# EAGLE design Grove - 6-Axis Accelerometer&Compass (EAGLE 6.4)
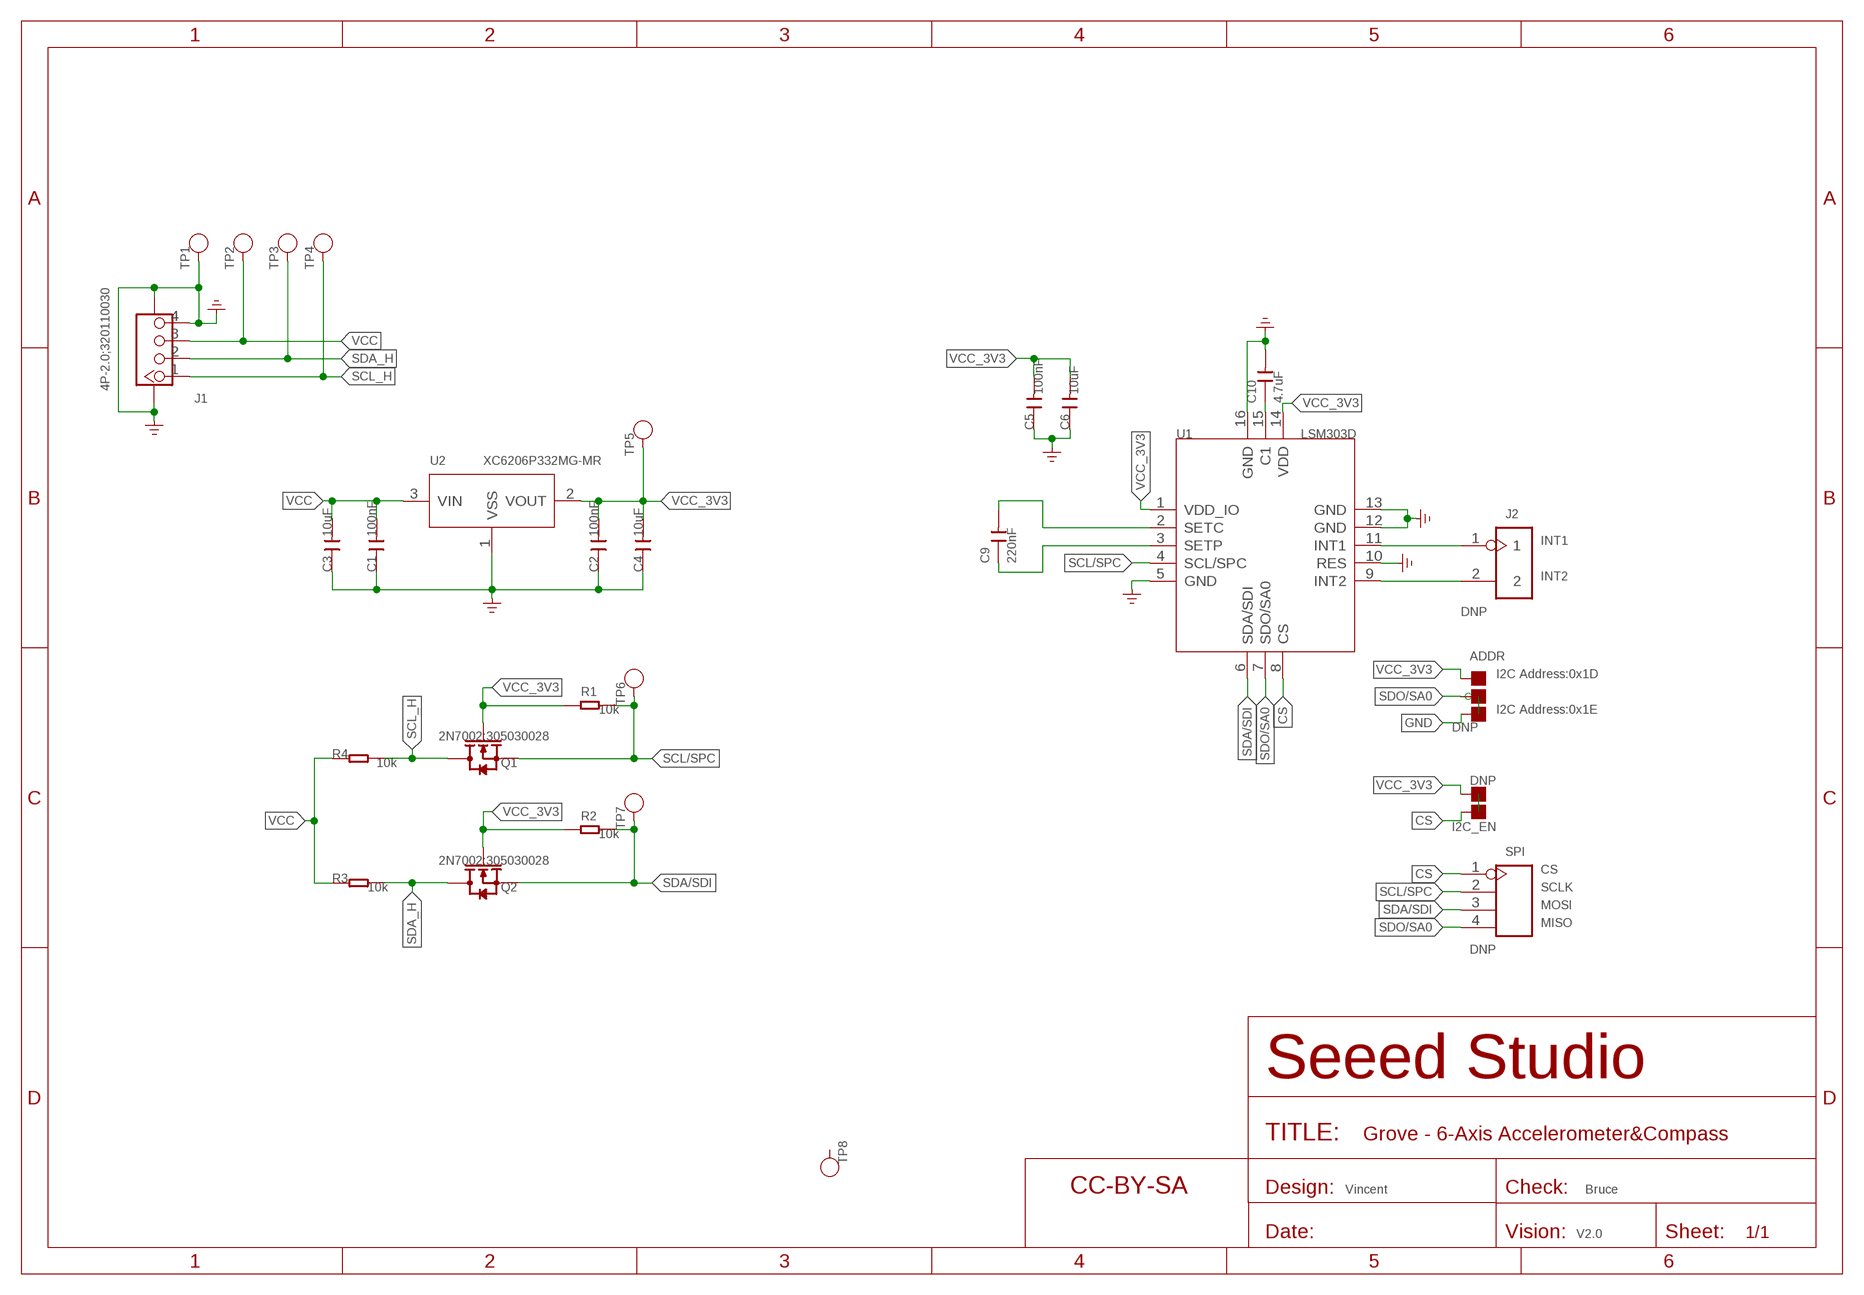
[diagram p0: schematic, sheet 1]

## Parts
ADDR  DNP  PAD-JUMPER-3P-40*40  [3P-SMD-L4.1*W1.5MM]
C1  100nF  CAP-0603  [C0603]
C2  100nF  CAP-0603  [C0603]
C3  10uF  CAP-0805  [C0805]
C4  10uF  CAP-0805  [C0805]
C5  100nF  CAP-0603  [C0603]
C6  10uF  CAP-0805  [C0805]
C9  220nF  CAP-0603  [C0603]
C10  4.7uF  CAP-0603  [C0603]
I2C_EN  DNP  PAD-JUMPER-2P  [2P-SMD-L1.78*W1.27MM]
J1  4P-2.0;320110030  GROVE-CONNECTOR-SMD'DD'  [4P-SMD-2.0]
J2  DNP  HEADER-2P-65/35MIL  [2P-2.54-65/35MIL]
Q1  2N7002;305030028  MOSFET-N'SOT23'  [SOT-23]
Q2  2N7002;305030028  MOSFET-N'SOT23'  [SOT-23]
R1  10k  RES-0603  [R0603]
R2  10k  RES-0603  [R0603]
R3  10k  RES-0603  [R0603]
R4  10k  RES-0603  [R0603]
SPI  DNP  HEADER-4P-65/35MIL  [4P-2.54-65/35MIL]
TP1  DNP  PAD-TEST-POINT'4545'  [TP-D45MIL]
TP2  DNP  PAD-TEST-POINT'4545'  [TP-D45MIL]
TP3  DNP  PAD-TEST-POINT'4545'  [TP-D45MIL]
TP4  DNP  PAD-TEST-POINT'4545'  [TP-D45MIL]
TP5  DNP  PAD-TEST-POINT'4545'  [TP-D45MIL]
TP6  DNP  PAD-TEST-POINT'4545'  [TP-D45MIL]
TP7  DNP  PAD-TEST-POINT'4545'  [TP-D45MIL]
TP8  DNP  PAD-TEST-POINT'4545'  [TP-D45MIL]
U1  LSM303D  [LGA-16]
U2  XC6206P332MG-MR  PMIC-XC6206PMR  [SOT-23]
U$1  SEEEDSTUDIO-OPEN-SCH-FRAME  [SEEEDSTUDIO-PCB-FRAME]

## Nets
CS: I2C_EN.2 SPI.1 U1.8(CS)
GND: ADDR.11(R) C1.1 C2.1 C3.1 C4.1 C5.1 C6.1 C10.2 J1.4 J1.SS1 J1.SS2 TP1.T U1.5(GND) U1.10(RES) U1.12(GND) U1.13(GND) U1.16(GND) U2.1(VSS) ; supply symbol labelled GND_POWER
N$1: C9.2 U1.2(SETC)
N$2: C9.1 U1.3(SETP)
N$4: C10.1 U1.15(C1)
N$11: J2.2 U1.9(INT2)
N$12: J2.1 U1.11(INT1)
SCL/SPC: Q1.2(S) R1.2 SPI.2 TP6.T U1.4(SCL/SPC)
SCL_H: J1.1 Q1.3(D) R4.2 TP4.T
SDA/SDI: Q2.2(S) R2.2 SPI.3 TP7.T U1.6(SDA/SDI)
SDA_H: J1.2 Q2.3(D) R3.2 TP3.T
SDO/SA0: ADDR.MM(C) SPI.4 U1.7(SDO/SA0)
VCC: C1.2 C3.2 J1.3 R3.1 R4.1 TP2.T U2.3(VIN)
VCC_3V3: ADDR.00(L) C2.2 C4.2 C5.2 C6.2 I2C_EN.1 Q1.1(G) Q2.1(G) R1.1 R2.1 TP5.T U1.1(VDD_IO) U1.14(VDD) U2.2(VOUT)
Unconnected: TP8.T

## Notes on the sheet
- INT1
- INT2
- I2C Address:0x1D
- I2C Address:0x1E
- CS
- SCLK
- MOSI
- MISO
- Vincent | Bruce
- V2.0

## Library data of the parts
ADDR = Discrete-new:PAD-JUMPER-3P; PARTNO: DNP
C1-C6 C9 C10 = Discrete-new:CAP: Ceramic Capacitors
I2C_EN = Discrete-new:PAD-JUMPER-2P; PARTNO: DNP
J1 = Connector-new:GROVE-CONNECTOR-SMD: 4P-SMD-2.0:320110030;4P-SMD-2.0-90D:320110032
J2 = Connector-new:HEADER-2P
Q1 Q2 = Discrete-new:MOSFET-N: IRLL014: http://www.vishay.com/docs/91319/sihll014.pdf
R1-R4 = Discrete-new:RES
SPI = Connector-new:HEADER-4P
TP1-TP8 = Discrete-new:PAD-TEST-POINT; PARTNO: DNP
U1 = template:LSM303D: Ultra-compact high-performance eCompass module: 3D accelerometer and 3D magnetometer
U2 = IC-new:PMIC-XC6206P: LOW ESR Cap.Compatible Positive Voltage Regulators
U$1 = moudle-new:SEEEDSTUDIO-OPEN-SCH-FRAME

## Net classes
0 default: width 0.152 mm, drill 0.305 mm, clearance 0.152 mm

## Board
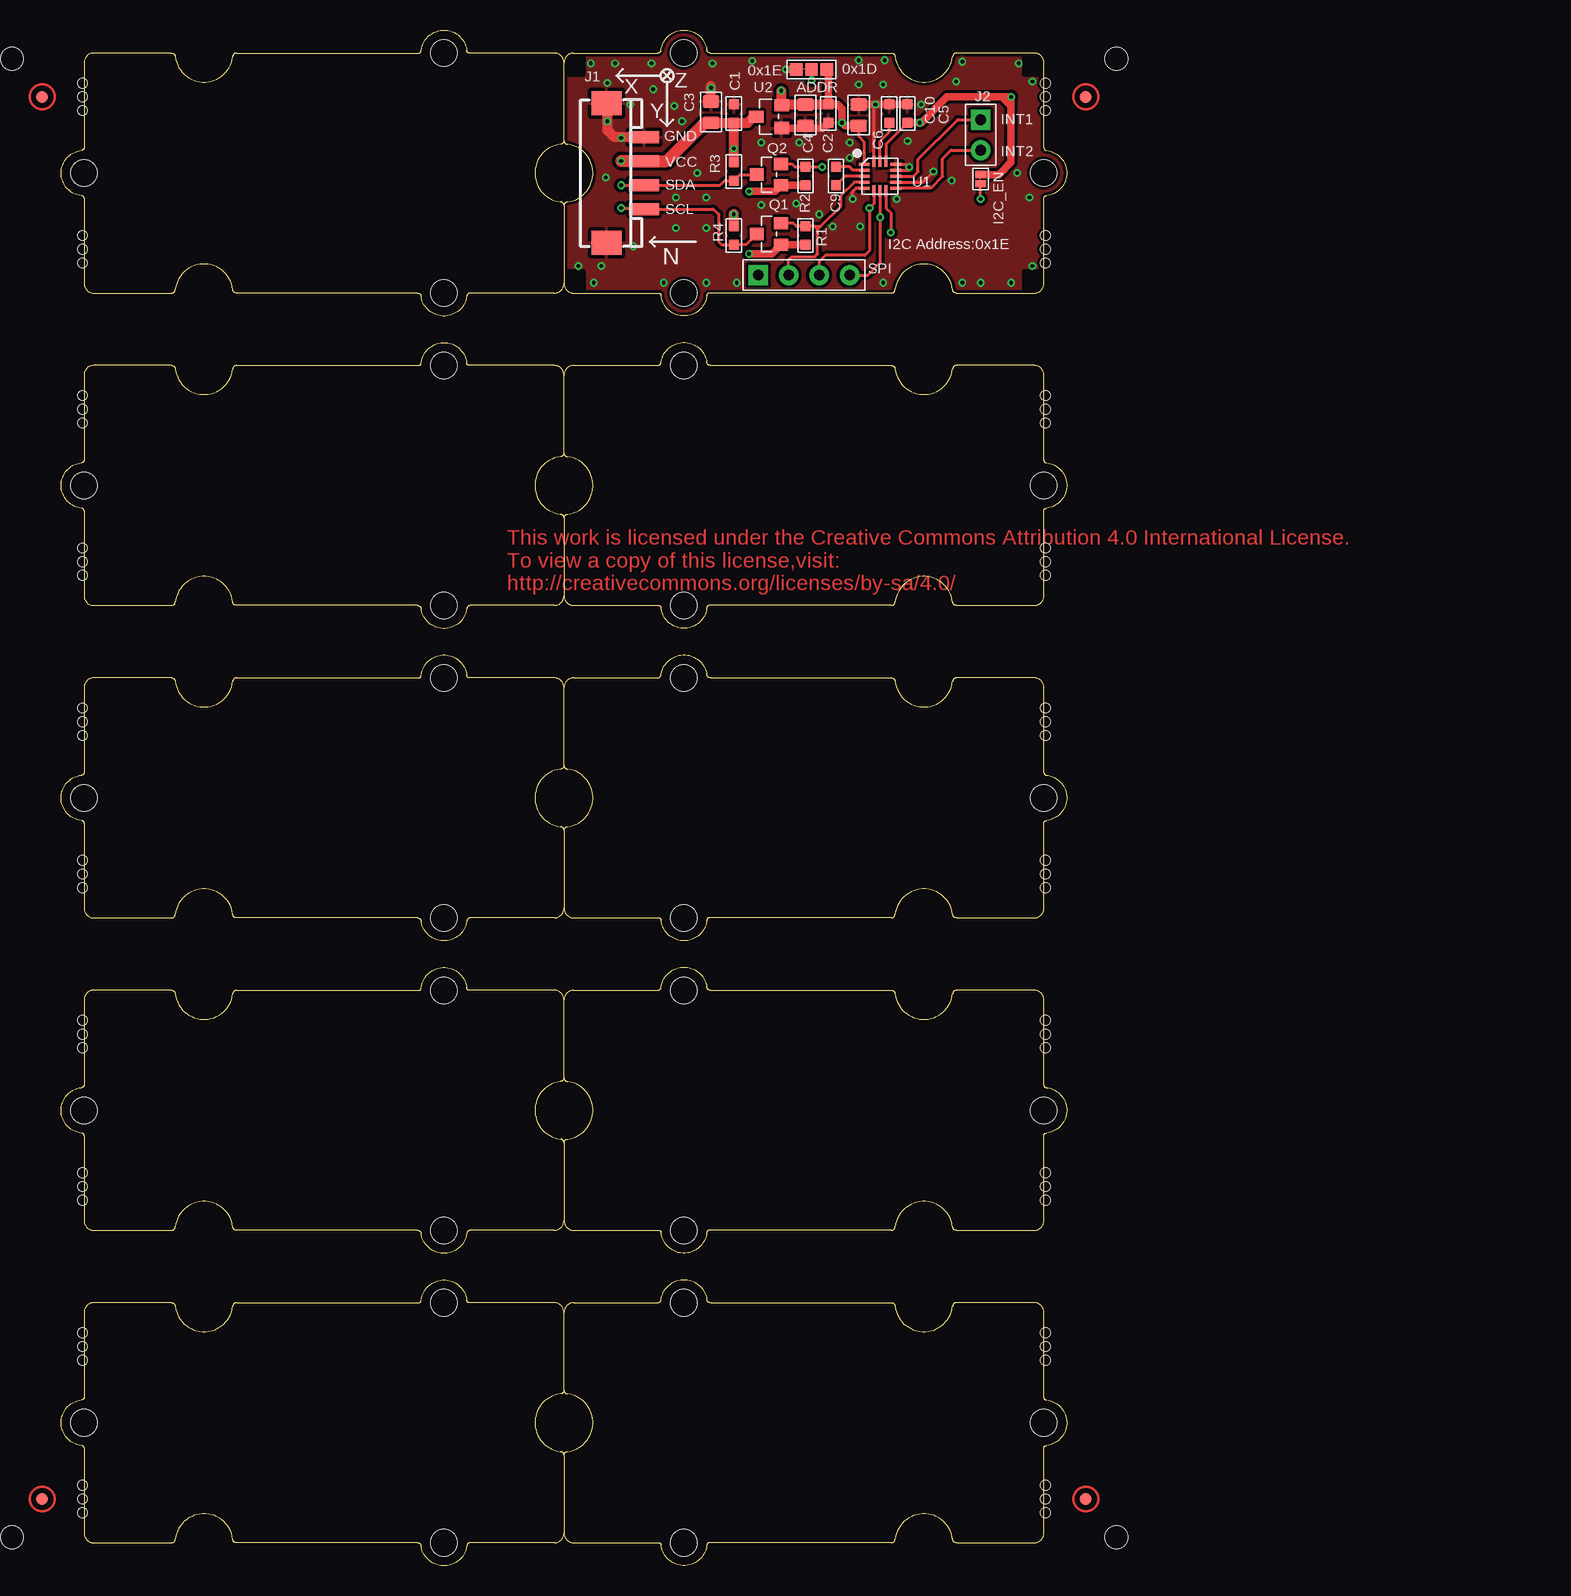
[diagram p1: board, top side]
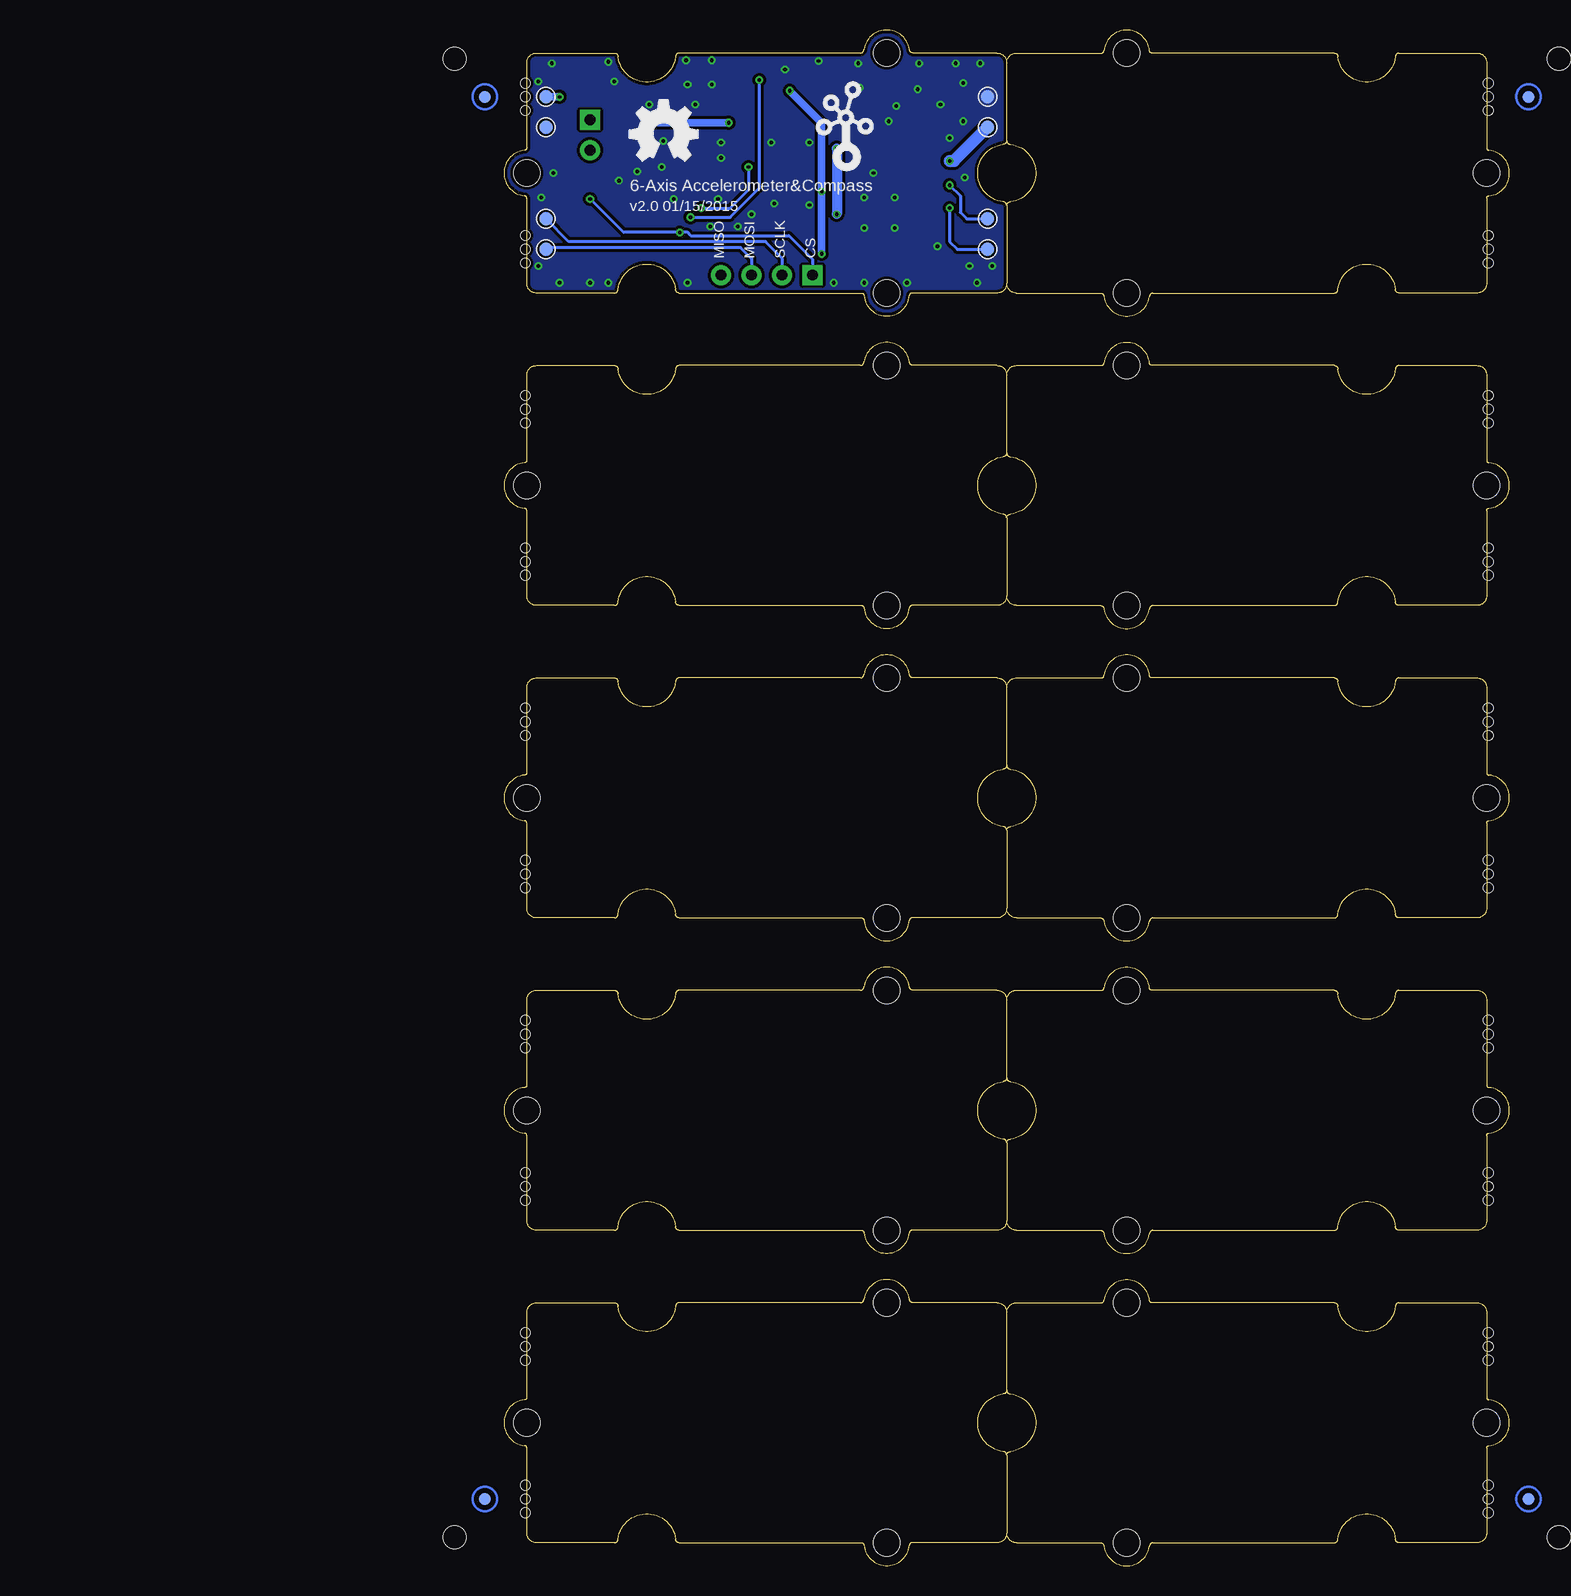
[diagram p2: board, bottom side, seen from below]

Size 83.82 x 127.98 mm. Coordinates in mm from the lower left corner, seen from the top.
Copper layers (1*16): Top 0.035mm / dielectric 1.5mm / Bottom 0.035mm
Design rules "SeeedStudio_2layer_DRU_no_angle_20140221 *": minimum track width 6mil, minimum drill 12mil, track to track 6mil, track to pad 6mil, pad to pad 6mil, via to via 6mil, smd to smd 0mil, copper to edge 10mil, drill to drill 10mil, minimum pad ring 10mil, minimum via ring 6mil, stop-mask expansion 2mil, vias tented up to drill 25mil, thermal gap 12mil
Holes 0.8 mm at 1.78,123.55 1.78,121.27 1.78,122.41 1.78,110.85 1.78,108.57 1.78,109.71 1.78,97.52 1.78,95.23 1.78,96.38 1.78,84.82 1.78,82.53 1.78,83.68 1.78,71.48 1.78,69.2 1.78,70.34 1.78,58.78 1.78,56.5 1.78,57.64 1.78,45.45 1.78,43.16 1.78,44.31 1.78,32.75 1.78,30.46 1.78,31.61 1.78,19.41 1.78,17.13 1.78,18.27 1.78,6.71 1.78,4.43 1.78,5.57 82.04,121.27 82.04,123.55 82.04,122.41 82.04,108.57 82.04,110.85 82.04,109.71 82.04,95.23 82.04,97.52 82.04,96.38 82.04,82.53 82.04,84.82 82.04,83.68 82.04,69.2 82.04,71.48 82.04,70.34 82.04,56.5 82.04,58.78 82.04,57.64 82.04,43.16 82.04,45.45 82.04,44.31 82.04,30.46 82.04,32.75 82.04,31.61 82.04,17.13 82.04,19.41 82.04,18.27 82.04,4.43 82.04,6.71 82.04,5.57
Holes 1.91 mm at -4.13,2.4 87.95,2.4 87.95,125.59 -4.13,125.59

### Footprints (pad centres in the part's own frame; a part is rotated, then mirrored left to right if it is on the bottom)
3P-SMD-L4.1*W1.5MM = smd 1.016 x 1.016: 00 -1.27,0; 11 1.27,0; MM 0,0
C0603 = smd 0.889 x 0.889: 1 -0.762,0; 2 0.762,0
C0805 = smd 1.016 x 1.397: 1 -0.889,0; 2 0.889,0
2P-SMD-L1.78*W1.27MM = smd 0.889 x 0.61: 1 0,0.381; 2 0,-0.381
4P-SMD-2.0 = smd 1 x 2.5: 1 -3,0; 2 -1,0; 3 1,0; 4 3,0 | smd 2 x 2.5: SS1 -5.8,3.123; SS2 5.8,3.123
2P-2.54-65/35MIL = drill 0.889 pad 1.651 square: 1 0,1.27 | drill 0.889 pad 1.651: 2 0,-1.27
ROUND-MARK-1.0 = smd 1.016 x 1.016: P$1 0,0
SOT-23 = smd 1.016 x 1.143: 1 -0.889,-1.016; 2 0.889,-1.016; 3 0,1.016
R0603 = smd 0.889 x 0.889: 1 -0.762,0; 2 0.762,0
4P-2.54-65/35MIL = drill 0.889 pad 1.651 square: 1 0,3.81 | drill 0.889 pad 1.651: 2 0,1.27; 3 0,-1.27; 4 0,-3.81
TP-D45MIL = smd 1.143 x 1.143: T 0,0
LGA-16 = smd 0.9 x 0.25: 1 -1.33,1; 2 -1.33,0.5; 3 -1.33,0; 4 -1.33,-0.5; 5 -1.33,-1; 9 1.33,-1; 10 1.33,-0.5; 11 1.33,0; 12 1.33,0.5; 13 1.33,1 | smd 0.25 x 0.9: 6 -0.5,-1.23; 7 0,-1.23; 8 0.5,-1.23; 14 0.5,1.23; 15 0,1.23; 16 -0.5,1.23
SOT-23' = smd 1.016 x 1.2: 1 -0.95,-1.06; 2 0.95,-1.06; 3 0,1.06
GROVE-TEST-PLATFORM = hole 2.2: -10,-10; -10,10; 20,0
GROVE-1*2-TEST-PLATFORM = hole 2.2: -10,-10; -10,10; 20,0

### Placement (x,y rotation side)
ADDR  62.55,124.7 180 top
C1  56.07,121.01 270 top
C2  63.95,121.01 90 top
C3  54.17,121.14 270 top
C4  62.04,120.89 90 top
C5  70.55,121.01 270 top
C6  66.49,120.89 270 top
C9  64.58,115.81 90 top
C10  69.03,121.01 90 top
I2C_EN  76.65,115.55 0 top
J1  48.58,116.06 90 top
J2  76.65,119.24 0 top
P1  [ROUND-MARK-1.0]  -1.59,5.57 0 top
P2  [ROUND-MARK-1.0]  85.41,5.57 0 top
P3  [ROUND-MARK-1.0]  -1.59,122.41 0 top
P4  [ROUND-MARK-1.0]  85.41,122.41 0 top
P5  [ROUND-MARK-1.0]  -1.59,5.57 0 bottom
P6  [ROUND-MARK-1.0]  85.41,5.57 0 bottom
P7  [ROUND-MARK-1.0]  85.41,122.41 0 bottom
P8  [ROUND-MARK-1.0]  -1.59,122.41 0 bottom
Q1  58.99,110.98 90 top
Q2  58.99,115.93 90 top
R1  62.04,110.85 90 top
R2  62.04,115.81 90 top
R3  56.07,116.19 270 top
R4  56.07,110.85 270 top
SPI  61.91,107.55 90 top
TP1  43.5,122.41 0 bottom
TP2  43.5,119.87 0 bottom
TP3  43.5,112.25 0 bottom
TP4  43.5,109.71 0 bottom
TP5  80.33,122.41 0 bottom
TP6  80.33,112.25 0 bottom
TP7  80.33,109.71 0 bottom
TP8  80.33,119.87 0 bottom
U1  68.26,115.81 0 top
U2  XC6206P332MG-MR  [SOT-23']  58.99,120.76 90 top
U3  [GROVE-TEST-PLATFORM]  61.91,37.96 0 top
U4  [GROVE-TEST-PLATFORM]  21.91,37.96 180 top
U5  [GROVE-TEST-PLATFORM]  61.91,63.99 0 top
U6  [GROVE-TEST-PLATFORM]  21.91,63.99 180 top
U7  [GROVE-TEST-PLATFORM]  61.91,90.03 0 top
U8  [GROVE-TEST-PLATFORM]  21.91,90.03 180 top
U9  [GROVE-TEST-PLATFORM]  21.91,116.06 180 top
U10  [GROVE-TEST-PLATFORM]  61.91,116.06 0 top
U11  [GROVE-TEST-PLATFORM]  61.91,11.92 0 top
U12  [GROVE-TEST-PLATFORM]  21.91,11.92 180 top
U$1  37.15,81.26 0 top
U$10  [GROVE-1*2-TEST-PLATFORM]  61.91,116.06 0 top
U$11  [GROVE-SILK-BIG]  55.31,117.2 0 bottom
U$12  [OSHW_FILLX200_NOTEXT]  73.34,117.08 0 bottom

### Tracks (layer width: path | path; a pad name or v marks a point on that pad's centre or on a via)
CS  (via drill 0.3 pad 0.64)
  Top 0.102: I2C_EN.2 76.65,115.93
  Top 0.254: U1.8 68.76,113.15 69.15,112.76 v69.15,111.11 | v76.65,113.9 I2C_EN.2
  Bottom 0.254: SPI.1 58.1,108.88 60.08,110.85 68.26,110.85 68.52,111.11 v69.15,111.11 73.85,111.11 v76.65,113.9
GND  (via drill 0.3 pad 0.64)
  Top 0.254: U1.16 67.76,121.66 v67.88,121.78 | U1.13 70.69,116.81 70.69,116.31 U1.12 | 66.76,114.81 66.25,114.81 65.98,114.54 v65.98,113.9 | U1.10 71.83,115.31 v72.71,116.19
  Top 0.61: C2.1 63.5,119.81 U2.1 59.95,119.81 | C6.1 v67.88,121.78 C5.1 | ADDR.11 v60.39,124.7
  Top 0.813: J1.4 46.09,119.06 45.53,119.62 45.53,121.79 J1.SS2 | C3.1 54.17,123.3
  other vias: 66.49,125.46 68.64,125.46 70.68,116.57 74.61,123.68 75.12,125.33 80.71,114.03 79.19,106.92 76.65,106.92 75.12,106.92 68.52,106.92 56.33,106.92 53.79,106.92 50.23,106.92 44.39,106.92 43.12,108.31 44.13,125.21 46.17,125.21 49.21,125.21 54.29,125.21 57.6,125.4 70.55,118.73 65.72,118.6 65.72,117.33 61.53,118.6 66.49,123.43 68.52,123.43 47.69,109.97 51.25,114.03 53.79,114.03 53.79,111.49 51.25,111.49 46.67,118.98 45.53,120.38 45.53,123.55 47.44,121.78 54.17,123.17 58.36,118.6 45.4,115.68 53.02,116.06 45.02,108.31 80.96,108.31 79.69,116.06 80.96,123.68 79.82,125.21 71.69,121.78 69.66,113.9 74.23,115.43 66.61,111.62 64.33,111.62 63.18,112.63 58.36,113.39 61.28,113.52 51.12,121.65 51.75,120.38 49.34,123.05
  pour Top (isolate 0.254, rank 2): 38.55,130.67 38.55,102.85 85.28,102.85 85.28,130.67
  pour Bottom (isolate 0.254): 38.55,130.67 38.55,102.85 85.28,102.85 85.28,130.67
N$1
  Top 0.254: U1.2 65.98,116.32 65.72,116.57 C9.2
N$2
  Top 0.254: U1.3 65.34,115.81 C9.1
N$4
  Top 0.254: U1.15 68.26,118.73 69.03,119.49 C10.1
N$11
  Top 0.254: J2.2 74.19,117.97 73.47,117.25 73.47,115.79 72.49,114.81 U1.9
N$12
  Top 0.254: U1.11 71.06,115.81 71.44,116.19 71.44,117.2 74.74,120.51 J2.1
SCL/SPC
  Top 0.254: 63.31,111.62 64.96,113.27 64.96,114.16 66.11,115.31 U1.4 | 62.8,111.62 63.31,111.62 | 60.26,111.62 Q1.2 61.02,111.87 61.28,111.62 R1.2 62.8,111.62 | 63.06,111.36 63.06,109.33 62.8,109.08 60.9,109.08 60.64,108.82 SPI.2 | 63.06,111.36 63.31,111.62 | 63.06,111.36 62.8,111.62
  Bottom 0.254: TP6.T 78.42,110.35 62.02,110.35 60.64,108.97 SPI.2
SCL_H  (via drill 0.3 pad 0.64)
  Top 0.254: J1.1 48.66,113.14 | Q1.3 57.09,110.09 R4.2 55.06,110.09 54.8,110.35 54.8,112.63 54.37,113.06 J1.1 | v46.67,113.14 48.5,113.14 J1.1
  Bottom 0.254: v46.67,113.14 46.67,110.35 46.04,109.71 TP4.T
SDA/SDI  (via drill 0.3 pad 0.64)
  Top 0.254: U1.6 67.76,114.57 67.76,113.52 v67.37,113.14 67.37,109.58 66.99,109.2 63.71,109.2 63.18,108.68 SPI.3 | Q2.2 60.9,116.82 61.15,116.57 R2.2 v63.44,116.57
  Bottom 0.254: v63.44,116.57 63.44,114.66 64.96,113.14 v67.37,113.14 | SPI.3 63.18,108.92 64.1,109.84 80.2,109.84 TP7.T
SDA_H  (via drill 0.3 pad 0.64)
  Top 0.254: Q2.3 56.58,115.93 R3.2 55.31,115.43 54.93,115.05 48.59,115.05 J1.2 48.56,115.05 v46.67,115.05
  Bottom 0.254: v46.67,115.05 45.78,114.16 45.78,112.79 45.25,112.25 TP3.T
SDO/SA0  (via drill 0.3 pad 0.64)
  Top 0.102: ADDR.MM 61.28,124.7
  Top 0.254: SPI.4 67.25,107.55 68.26,108.57 v68.26,112.38 U1.7 | ADDR.MM v62.55,123.81
  Bottom 0.254: v68.26,112.38 64.96,112.38 62.55,114.79 v62.55,123.81
VCC  (via drill 0.3, 0.3 pad 0.64)
  Top 0.813: C3.2 C1.2 | C1.2 57.21,120.25 57.72,120.76 U2.3 | R3.1 v56.07,118.09 C1.2 | R4.1 v56.07,112.63
  Top 1.016: v46.67,117.08 46.69,117.06 J1.3 50.47,117.06 53.66,120.25 C3.2
  Bottom 0.813: v56.07,118.09 v56.07,112.63
  Bottom 1.016: v46.67,117.08 46.29,117.08 TP2.T
VCC_3V3  (via drill 0.3 pad 0.64)
  Top 0.254: 66.92,116.82 U1.1 66.93,118.66 66.49,119.11 C6.2 | C5.2 68.76,118.47 U1.14
  Top 0.61: C6.2 65.34,120 v65.09,120.25 65.09,121.42 64.73,121.78 C2.2 63.95,124.57 ADDR.00 | 61.91,110.09 R1.1 Q1.1 59.25,109.33 v57.34,109.33 | C5.2 v71.57,120.25 71.69,120.25 73.85,122.41 78.42,122.41 | 78.42,122.41 v79.19,122.41 79.19,121.78 | 79.19,121.78 79.19,116.95 78.17,115.93 I2C_EN.1 | 79.19,121.78 79.06,121.78 78.42,122.41 | R2.1 Q2.1 | Q2.1 59.88,115.05 | v57.34,114.54 59.5,114.54 Q2.1
  Top 0.813: C2.2 C4.2 60.12,121.78 U2.2 60.01,121.75 v60.01,122.92
  Bottom 0.61: v71.57,120.25 v65.09,120.25 | TP5.T v79.19,122.41 | v57.34,109.33 v57.34,114.54 57.34,120.25 v60.01,122.92

### Text on the board
tPlace: 0x1E | 0x1D | X | Z | Y | INT1 | GND | VCC | INT2 | SDA | SCL | I2C Address:0x1E | N
bPlace: 6-Axis Accelerometer&Compass | v2.0 01/15/2015 | CS | SCLK | MOSI | MISO